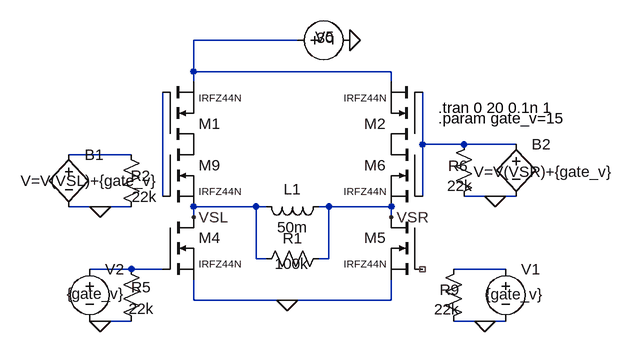
[diagram p0: schematic Motor_Driver.asc]
Motor_Driver.asc, the LTspice schematic file:
Version 4
SHEET 1 1900 696
WIRE 144 -96 -16 -96
WIRE -16 -48 -16 -96
WIRE 288 -48 -16 -48
WIRE -16 -32 -16 -48
WIRE 288 -32 288 -48
WIRE 336 64 336 -16
WIRE 400 64 336 64
WIRE 480 64 400 64
WIRE -112 80 -208 80
WIRE -64 144 -64 -16
WIRE 336 144 336 64
WIRE 448 144 400 144
WIRE 480 144 448 144
WIRE -160 160 -208 160
WIRE -112 160 -160 160
WIRE 80 160 -16 160
WIRE 96 160 80 160
WIRE 192 160 176 160
WIRE 288 160 192 160
WIRE -16 176 -16 160
WIRE 288 176 288 160
WIRE 80 240 80 160
WIRE 96 240 80 240
WIRE 192 240 192 160
WIRE 192 240 176 240
WIRE -112 256 -176 256
WIRE -64 256 -112 256
WIRE 464 256 384 256
WIRE -16 304 -16 272
WIRE 128 304 -16 304
WIRE 288 304 288 272
WIRE 288 304 128 304
WIRE -160 336 -176 336
WIRE -112 336 -160 336
WIRE 432 336 384 336
WIRE 464 336 432 336
FLAG -16 176 VSL
FLAG 288 176 VSR
FLAG -160 160 0
FLAG -160 336 0
FLAG 448 144 0
FLAG 432 336 0
FLAG 224 -96 0
FLAG 128 304 0
SYMBOL ind 192 144 R90
WINDOW 0 5 56 VBottom 2
WINDOW 3 32 56 VTop 2
SYMATTR InstName L1
SYMATTR Value 50m
SYMATTR SpiceLine Rser=3
SYMBOL nmos -64 176 R0
WINDOW 3 56 72 Left 1
SYMATTR Value IRFZ44N
SYMATTR InstName M4
SYMBOL nmos 336 176 M0
WINDOW 3 56 72 Left 1
SYMATTR Value IRFZ44N
SYMATTR InstName M5
SYMBOL nmos 336 64 M0
WINDOW 3 56 72 Left 1
SYMATTR Value IRFZ44N
SYMATTR InstName M6
SYMBOL res -128 64 R0
WINDOW 0 15 48 Left 2
WINDOW 3 17 81 Left 2
SYMATTR InstName R2
SYMATTR Value 22k
SYMBOL voltage 128 -96 R270
WINDOW 0 21 58 VBottom 2
WINDOW 3 -12 59 VTop 2
WINDOW 123 0 0 Left 0
WINDOW 39 0 0 Left 0
SYMATTR InstName V5
SYMATTR Value 30
SYMBOL nmos -64 64 R0
WINDOW 3 56 72 Left 1
SYMATTR Value IRFZ44N
SYMATTR InstName M9
SYMBOL res -128 240 R0
WINDOW 0 16 44 Left 2
WINDOW 3 12 77 Left 2
SYMATTR InstName R5
SYMATTR Value 22k
SYMBOL res 416 48 M0
WINDOW 0 10 49 Left 2
WINDOW 3 3 80 Left 2
SYMATTR InstName R6
SYMATTR Value 22k
SYMBOL res 400 240 M0
WINDOW 0 7 48 Left 2
WINDOW 3 7 78 Left 2
SYMATTR InstName R9
SYMATTR Value 22k
SYMBOL bv -208 64 R0
WINDOW 3 -74 56 Left 2
SYMATTR Value V=V(VSL)+{gate_v}
SYMATTR InstName B1
SYMBOL bv 480 48 R0
WINDOW 3 -65 58 Left 2
SYMATTR Value V=V(VSR)+{gate_v}
SYMATTR InstName B2
SYMBOL voltage 464 240 R0
WINDOW 123 0 0 Left 0
WINDOW 39 0 0 Left 0
WINDOW 3 -31 55 Left 2
SYMATTR Value {gate_v}
SYMATTR InstName V1
SYMBOL voltage -176 240 R0
WINDOW 123 0 0 Left 0
WINDOW 39 0 0 Left 0
WINDOW 3 -35 54 Left 2
SYMATTR Value {gate_v}
SYMATTR InstName V2
SYMBOL nmos -64 64 M180
WINDOW 3 56 72 Left 1
SYMATTR Value IRFZ44N
SYMATTR InstName M1
SYMBOL nmos 336 64 R180
WINDOW 3 56 72 Left 1
SYMATTR Value IRFZ44N
SYMATTR InstName M2
SYMBOL res 192 224 R90
WINDOW 0 0 56 VBottom 2
WINDOW 3 8 57 VTop 2
SYMATTR InstName R1
SYMATTR Value 100k
TEXT 360 8 Left 2 !.tran 0 20 0.1n 1
TEXT 360 24 Left 2 !.param gate_v=15

The netlist it stands for:
* Motor_Driver.asc
L1 VSR VSL 50m Rser=3
M4 VSL N005 0 0 IRFZ44N
M5 VSR NC_01 0 0 IRFZ44N
M6 P001 N002 VSR VSR IRFZ44N
R2 N003 0 22k
V5 N001 0 30
M9 P002 N004 VSL VSL IRFZ44N
R5 N005 0 22k
R6 N002 0 22k
R9 N006 0 22k
B1 N003 0 V=V(VSL)+{gate_v}
B2 N002 0 V=V(VSR)+{gate_v}
V1 N006 0 {gate_v}
V2 N005 0 {gate_v}
M1 P002 N004 N001 N001 IRFZ44N
M2 P001 N002 N001 N001 IRFZ44N
R1 VSR VSL 100k
.model NMOS NMOS
.model PMOS PMOS
.lib standard.mos
.tran 0 20 0.1n 1
.param gate_v=15
.backanno
.end